# EasyEDA Pro project Controller Board DS-PI.epro, schematic Schematic1
Create Date: 2025-11-25; Page Name: P1; Project Name: DSBOARD; Schematic Name: Schematic1; Update Date: 2025-11-30; Company: EasyEDA.com; Page Size: A4; Version: V1.0
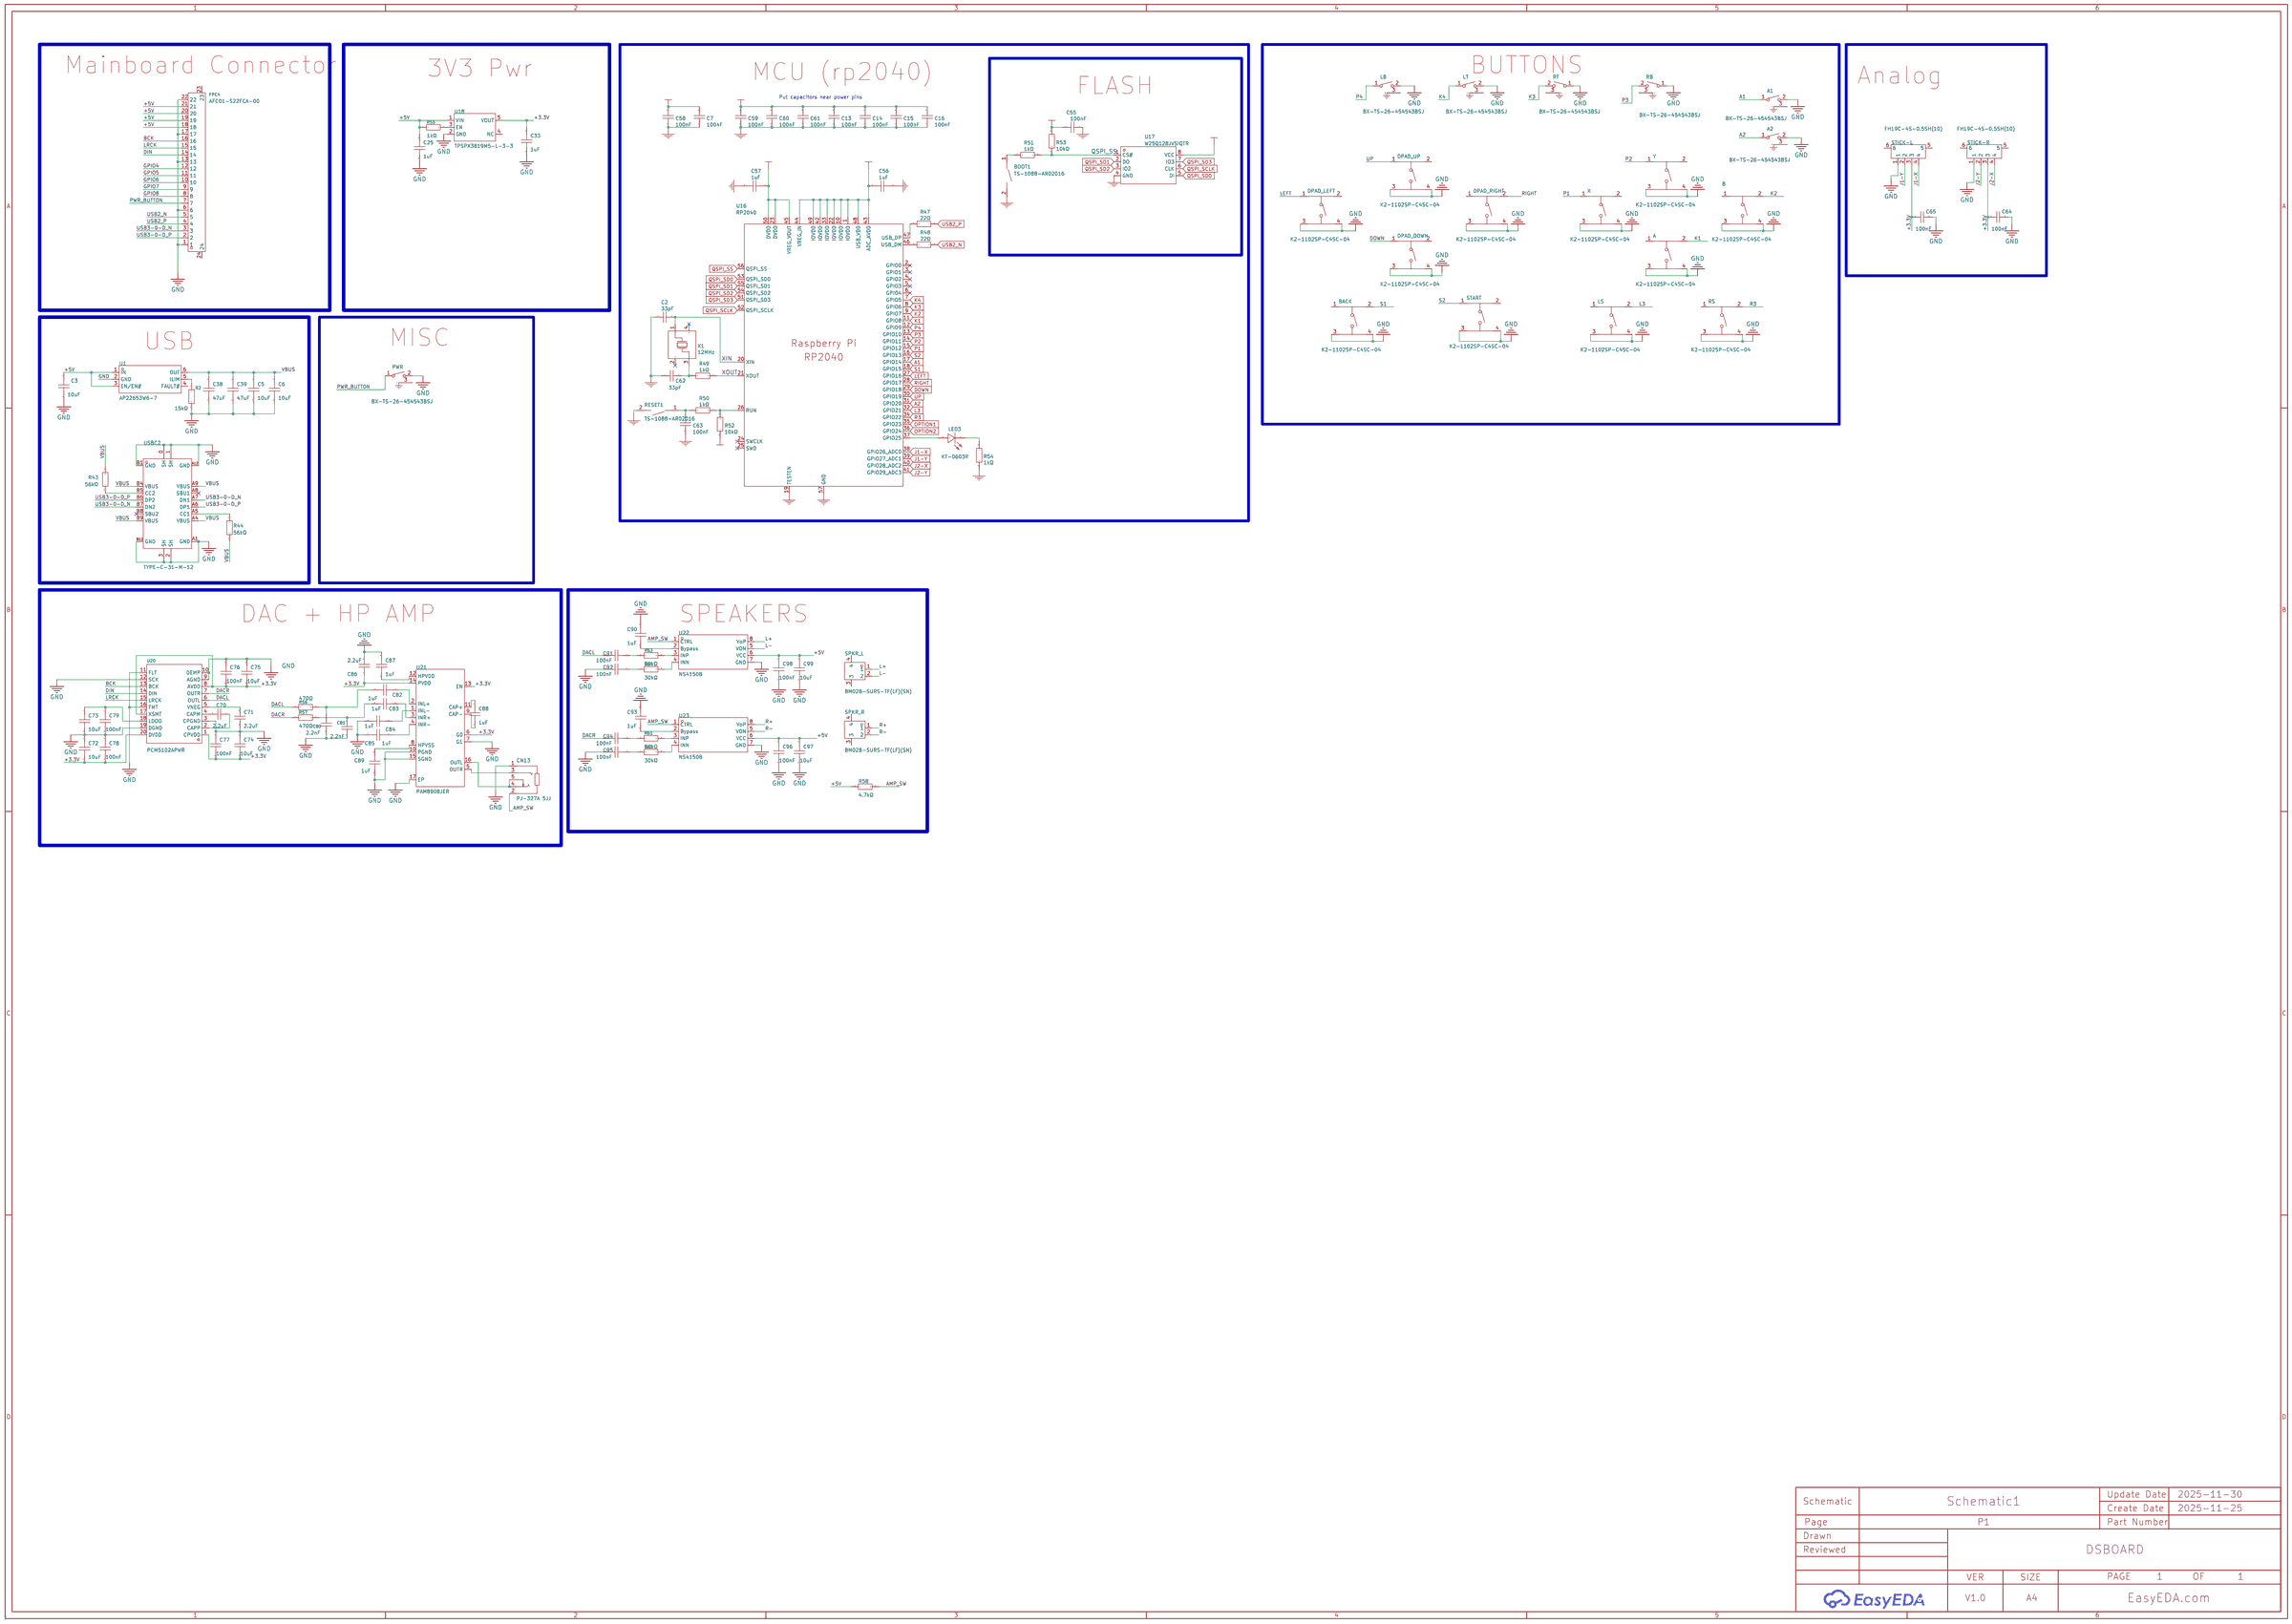
[diagram p0: schematic sheet]

## Parts
A  K2-1102SP-C4SC-04  [KEY-SMD_4P-L6.0-W6.0-P4.50-LS9.5-BL]  (no BOM)
A1  BX-TS-26-454543BSJ  [SW-TH_3P-L4.5-W4.3-P3.00-LS1.9]  (no BOM)
A2  BX-TS-26-454543BSJ  [SW-TH_3P-L4.5-W4.3-P3.00-LS1.9]  (no BOM)
B  K2-1102SP-C4SC-04  [KEY-SMD_4P-L6.0-W6.0-P4.50-LS9.5-BL]  (no BOM)
BACK  K2-1102SP-C4SC-04  [KEY-SMD_4P-L6.0-W6.0-P4.50-LS9.5-BL]  (no BOM)
BOOT1  TS-1088-AR02016  [SW-SMD_L3.9-W3.0-P4.45]
C2  33pF  [C0402]
C3  10uF  [C0805]
C5  10uF  [C0805]
C6  10uF  [C0805]
C7  100nF  [C0402]
C13  100nF  [C0402]
C14  100nF  [C0402]
C15  100nF  [C0402]
C16  100nF  [C0402]
C25  1uF  [C0603]
C33  1uF  [C0603]
C38  47uF  [C1206]
C39  47uF  [C1206]
C55  100nF  [C0402]
C56  1uF  [C0402]
C57  1uF  [C0402]
C58  100nF  [C0402]
C59  100nF  [C0402]
C60  100nF  [C0402]
C61  100nF  [C0402]
C62  33pF  [C0402]
C63  100nF  [C0402]
C64  100nF  [c0402]
C65  100nF  [c0402]
C70  2.2uF  [C0603]
C71  2.2uF  [C0603]
C72  10uF  [C0805]
C73  10uF  [C0805]
C74  10uF  [C0805]
C75  10uF  [C0805]
C76  100nF  [C0603]
C77  100nF  [C0603]
C78  100nF  [C0603]
C79  100nF  [C0603]
C80  2.2nF  [C0805]
C81  2.2nF  [C0805]
C82  1uF  [C0603]
C83  1uF  [C0603]
C84  1uF  [C0603]
C85  1uF  [C0603]
C86  2.2uF  [C0603]
C87  1uF  [C0603]
C88  1uF  [C0603]
C89  1uF  [C0603]
C90  1uF  [C0603]
C91  100nF  [C0402]
C92  100nF  [C0402]
C93  1uF  [C0603]
C94  100nF  [C0402]
C95  100nF  [C0402]
C96  100nF  [C0402]
C97  10uF  [C0805]
C98  100nF  [C0402]
C99  10uF  [C0805]
CN13  PJ-327A 5JJ  [AUDIO-SMD_PJ-327A5JJ]
DPAD_DOWN  K2-1102SP-C4SC-04  [KEY-SMD_4P-L6.0-W6.0-P4.50-LS9.5-BL]  (no BOM)
DPAD_LEFT  K2-1102SP-C4SC-04  [KEY-SMD_4P-L6.0-W6.0-P4.50-LS9.5-BL]  (no BOM)
DPAD_RIGHT  K2-1102SP-C4SC-04  [KEY-SMD_4P-L6.0-W6.0-P4.50-LS9.5-BL]  (no BOM)
DPAD_UP  K2-1102SP-C4SC-04  [KEY-SMD_4P-L6.0-W6.0-P4.50-LS9.5-BL]  (no BOM)
FPC4  AFC01-S22FCA-00  [FPC-SMD_P0.5-22P_FGS-XJ-H2.0]
LB  BX-TS-26-454543BSJ  [SW-TH_3P-L4.5-W4.3-P3.00-LS1.9]  (no BOM)
LED3  KT-0603R  [LED0603-RD]
LS  K2-1102SP-C4SC-04  [KEY-SMD_4P-L6.0-W6.0-P4.50-LS9.5-BL]  (no BOM)
LT  BX-TS-26-454543BSJ  [SW-TH_3P-L4.5-W4.3-P3.00-LS1.9]  (no BOM)
PWR  BX-TS-26-454543BSJ  [SW-TH_3P-L4.5-W4.3-P3.00-LS1.9]  (no BOM)
R2  15kΩ  [R0402]
R43  56kΩ  [R0402]
R44  56kΩ  [R0402]
R47  22Ω  [R0402]
R48  22Ω  [R0402]
R49  1kΩ  [R0402]
R50  1kΩ  [R0402]
R51  1kΩ  [R0402]
R52  10kΩ  [R0402]
R53  10kΩ  [R0402]
R54  1kΩ  [R0402]
R55  1kΩ  [R0402]
R56  470Ω  [R0805]
R57  470Ω  [R0805]
R58  4.7kΩ  [R0603]
R61  30kΩ  [R0603]
R62  30kΩ  [R0603]
R63  30kΩ  [R0603]
R64  30kΩ  [R0603]
RB  BX-TS-26-454543BSJ  [SW-TH_3P-L4.5-W4.3-P3.00-LS1.9]  (no BOM)
RESET1  TS-1088-AR02016  [SW-SMD_L3.9-W3.0-P4.45]
RS  K2-1102SP-C4SC-04  [KEY-SMD_4P-L6.0-W6.0-P4.50-LS9.5-BL]  (no BOM)
RT  BX-TS-26-454543BSJ  [SW-TH_3P-L4.5-W4.3-P3.00-LS1.9]  (no BOM)
SPKR_L  BM02B-SURS-TF(LF)(SN)  [CONN-SMD_2P-P0.80_BM02B-SURS-TF-LF-SN]
SPKR_R  BM02B-SURS-TF(LF)(SN)  [CONN-SMD_2P-P0.80_BM02B-SURS-TF-LF-SN]
START  K2-1102SP-C4SC-04  [KEY-SMD_4P-L6.0-W6.0-P4.50-LS9.5-BL]  (no BOM)
STICK-L  FH19C-4S-0.5SH(10)  [FPC-SMD_FH19C-4S-0.5SH]
STICK-R  FH19C-4S-0.5SH(10)  [FPC-SMD_FH19C-4S-0.5SH]
U1  AP22653W6-7  [SOT-23-6_L2.9-W1.6-P0.95-LS2.8-BR]
U16  RP2040  [LQFN-56_L7.0-W7.0-P0.4-EP]
U17  W25Q128JVSIQTR  [SOIC-8_L5.3-W5.3-P1.27-LS8.0-BL]
U18  TPSPX3819M5-L-3-3  [SOT-23-5_L3.0-W1.6-P0.95-LS2.8-BR]
U20  PCM5102APWR  [TSSOP-20_L6.5-W4.4-P0.65-LS6.4-BL]
U21  PAM8908JER  [QFN-16_L3.0-W3.0-P0.50-BL-EP1.7]
U22  NS4150B  [MSOP-8_L3.0-W3.0-P0.65-LS5.0-BL]
U23  NS4150B  [MSOP-8_L3.0-W3.0-P0.65-LS5.0-BL]
USBC2  TYPE-C-31-M-12  [USB-C_SMD-TYPE-C-31-M-12]
X  K2-1102SP-C4SC-04  [KEY-SMD_4P-L6.0-W6.0-P4.50-LS9.5-BL]  (no BOM)
X1  12MHz  [OSC-SMD_4P-L3.2-W2.5-BL]
Y  K2-1102SP-C4SC-04  [KEY-SMD_4P-L6.0-W6.0-P4.50-LS9.5-BL]  (no BOM)

## Library data of the parts
A B BACK DPAD_DOWN DPAD_LEFT DPAD_RIGHT DPAD_UP LS RS START X Y = K2-1102SP-C4SC-04: Circuit:SPST Actuator Style:Round Button Operating Force:250gf Mounting Style:Brick nogging Switch Length:6mm Switch Width:6mm Switch Height:5mm Contact Current:50mA Voltage Rating (DC):12V Insulation Resistance:100MΩ With Lamp:- Mechanical Life:10万次 Oper; LCSC Part Name: K2-1102SP-C4SC-04 贴片; Supplier Part: C127509; Manufacturer: 韩国韩荣; Supplier Footprint: SMD; JLCPCB Part Class: Extended Part; Datasheet: https://atta.szlcsc.com/upload/public/pdf/source/20180911/C188182_290538218D9CAA74C9E437566D743B7F.pdf; Supplier: LCSC; Circuit: SPST; Actuator Style: Round Button; Operating Force: 250gf; Mounting Style: Brick nogging; Switch Length: 6mm; Switch Width: 6mm; Switch Height: 5mm; Contact Current: 50mA; Voltage Rating (DC): 12V; Insulation Resistance: 100MΩ; Mechanical Life: 10万次; Operating Temperature: -25℃~+85℃
A1 A2 LB LT PWR RB RT = BX-TS-26-454543BSJ: Circuit:SPST Actuator Style:Round Button Operating Force:260gf Mounting Style:Direct Insert Switch Length:4.5mm Switch Width:4.5mm Switch Height:4.3mm Strike Gundam:Without bracket Contact Current:50mA Voltage Rating:12V Actuator/Cap Color:Black Pin Style; LCSC Part Name: 4.5x4.5x4.3边三脚; Supplier Part: C18078076; Manufacturer: Bossie(博锡); Supplier Footprint: 插件-3P,4.5x4.5mm; JLCPCB Part Class: Extended Part; Datasheet: https://atta.szlcsc.com/upload/public/pdf/source/20231017/C9E2CC52EFF4A1EA78B90A8989680BD6.pdf; Supplier: LCSC; Circuit: SPST; Actuator Style: Round Button; Operating Force: 260gf; Mounting Style: Direct Insert; Switch Length: 4.5mm; Switch Width: 4.5mm; Switch Height: 4.3mm; Strike Gundam: Without bracket; Contact Current: 50mA; Voltage Rating: 12V; Actuator/Cap Color: Black; Pin Style: PCPin; Mechanical Life: 100000 Times; Operating Temperature: -30℃~+80℃
BOOT1 RESET1 = TS-1088-AR02016: Circuit:SPST Actuator Style:Round Button Operating Force:160gf Mounting Style:Brick nogging Switch Length:4mm Switch Width:3mm Switch Height:2mm Strike Gundam:不带 Contact Current:50mA Voltage Rating (DC):12V Insulation Resistance:100MΩ Actuator/Cap Color:B; LCSC Part Name: 4*3*2mm 立贴 轻触开关; Supplier Part: C720477; Manufacturer: XUNPU(讯普); Supplier Footprint: SMD; JLCPCB Part Class: Basic Part; Datasheet: https://atta.szlcsc.com/upload/public/pdf/source/20200810/C720475_60D09DD6C54279ADDB2DC25100F1CC11.pdf; Supplier: LCSC; Circuit: SPST; Actuator Style: Round Button; Operating Force: 160gf; Mounting Style: Brick nogging; Switch Length: 4mm; Switch Width: 3mm; Switch Height: 2mm; Strike Gundam: 不带; Contact Current: 50mA; Voltage Rating (DC): 12V; Insulation Resistance: 100MΩ; Actuator/Cap Color: Black; Pin Style: SMDSplicing; Mechanical Life: 10万次; Operating Temperature: -30℃~+80℃
C2 C62 = 0402CG330J500NT: Supplier: LCSC; Manufacturer: FH(风华); Supplier Part: C1562; JLCPCB Part Class: Basic Part
C3 C5 C6 C97 C99 = CL21A106KAYNNNE_C15850: Capacitance: Tolerance:±10% Tolerance:±10% Voltage Rated: Temperature Coefficient:; LCSC Part Name: 10uF ±10% 25V; Supplier Part: C15850; Manufacturer: SAMSUNG(三星); Manufacturer Part: CL21A106KAYNNNE; Supplier Footprint: 0805; JLCPCB Part Class: Basic Part; Datasheet: https://atta.szlcsc.com/upload/public/pdf/source/20160218/1457707763339.pdf; Supplier: LCSC; Tolerance: ±10%
C7 C13-C16 C55 C58-C61 C63-C65 = CL05B104KO5NNNC: Supplier: LCSC; Manufacturer: SAMSUNG(三星); Supplier Part: C1525; JLCPCB Part Class: Basic Part
C25 C33 C82-C85 C87-C90 C93 = CL10A105KB8NNNC: Capacitance: Tolerance:±10% Tolerance:±10% Voltage Rated: Temperature Coefficient:; LCSC Part Name: 1uF ±10% 50V; Supplier Part: C15849; Manufacturer: SAMSUNG(三星); Supplier Footprint: 0603; JLCPCB Part Class: Basic Part; Datasheet: https://atta.szlcsc.com/upload/public/pdf/source/20160218/1457707763339.pdf; Supplier: LCSC; Tolerance: ±10%
C38 C39 = CL31A476MPHNNNE: Capacitance: Tolerance:±20% Tolerance:±20% Voltage Rated: Temperature Coefficient:; LCSC Part Name: 47uF ±20% 10V; Supplier Part: C96123; Manufacturer: SAMSUNG(三星); Supplier Footprint: 1206; JLCPCB Part Class: Basic Part; Datasheet: https://atta.szlcsc.com/upload/public/pdf/source/20160218/1457707763339.pdf; Supplier: LCSC; Tolerance: ±20%
C56 C57 = CL05A105KA5NQNC: Supplier: LCSC; Manufacturer: SAMSUNG(三星); Supplier Part: C52923; JLCPCB Part Class: Basic Part
C70 C71 C86 = CL10A225KO8NNNC: Capacitance: Tolerance:±10% Tolerance:±10% Voltage Rated: Temperature Coefficient:; LCSC Part Name: 2.2uF ±10% 16V; Supplier Part: C23630; Manufacturer: SAMSUNG(三星); Supplier Footprint: 0603; JLCPCB Part Class: Basic Part; Datasheet: https://atta.szlcsc.com/upload/public/pdf/source/20160218/1457707763339.pdf; Supplier: LCSC; Tolerance: ±10%
C72-C75 = GRM21BR61H106KE43L: Capacitance: Tolerance:±10% Tolerance:±10% Voltage Rated: Temperature Coefficient:; LCSC Part Name: 10uF ±10% 50V; Supplier Part: C440198; Manufacturer: muRata(村田); Supplier Footprint: 0805; JLCPCB Part Class: Basic Part; Datasheet: https://atta.szlcsc.com/upload/public/pdf/source/20230811/95AAE0C9AF55EDC31B7A4D8B733F534E.pdf; Supplier: LCSC; Tolerance: ±10%
C76-C79 = CC0603KRX7R9BB104: Capacitance:100nF Tolerance:±10% Tolerance:±10% Voltage Rating:50V Temperature Coefficient:X7R; LCSC Part Name: 100nF ±10% 50V; Supplier Part: C14663; Manufacturer: YAGEO(国巨); Supplier Footprint: 0603; JLCPCB Part Class: Basic Part; Datasheet: https://atta.szlcsc.com/upload/public/pdf/source/20180910/C282072_33301C7F631E79921B82A8DAC6BCC5B3.pdf; Supplier: LCSC; Tolerance: ±10%; Voltage Rating: 50V; Temperature Coefficient: X7R
C80 C81 = CL21C222JBFNNNE: Capacitance: Tolerance:±5% Tolerance:±5% Voltage Rated: Temperature Coefficient:; LCSC Part Name: 2.2nF ±5% 50V; Supplier Part: C28260; Manufacturer: SAMSUNG(三星); Supplier Footprint: 0805; JLCPCB Part Class: Basic Part; Datasheet: https://atta.szlcsc.com/upload/public/pdf/source/20160218/1457707763339.pdf; Supplier: LCSC; Tolerance: ±5%
C91 C92 C94-C96 C98 = CL05B104KB54PNC: Capacitance: Tolerance:±10% Tolerance:±10% Voltage Rated: Temperature Coefficient:; LCSC Part Name: 100nF ±10% 50V; Supplier Part: C307331; Manufacturer: SAMSUNG(三星); Supplier Footprint: 0402; JLCPCB Part Class: Basic Part; Datasheet: https://atta.szlcsc.com/upload/public/pdf/source/20160218/1457707763339.pdf; Supplier: LCSC; Tolerance: ±10%
CN13 = PJ-327A 5JJ: Connector Type:3.5mm Headphone Jack Current Rating:500mA Voltage Rating (Max):30V Contact Material:- Contact Plating:Gold Operating Temperature:-30℃~+70℃ Operating Temperature:-30℃~+70℃; LCSC Part Name: 3.5mm耳机座; Supplier Part: C668605; Manufacturer: SHOU HAN(首韩); Supplier Footprint: SMD; JLCPCB Part Class: Extended Part; Datasheet: https://item.szlcsc.com/datasheet/PJ-327A%25205JJ/698548.html; Supplier: LCSC; Connector Type: 3.5mm Headphone Jack; Current Rating: 500mA; Voltage Rating (Max): 30V; Contact Plating: Gold; Operating Temperature: -30℃~+70℃
FPC4 = AFC01-S22FCA-00: Locking Feature:Clamshell Contact Type:Bottom Contact Number of Contacts:22P Pitch:0.5mm Mounting Type:卧贴 FFC, FCB Thickness:0.3mm FFC, FCB Thickness:0.3mm Height Above Board:2mm; LCSC Part Name: 间距:0.5mm P数:22P 翻盖式 下接; Supplier Part: C262668; Manufacturer: JS(钜硕电子); Supplier Footprint: SMD,P=0.5mm,卧贴; JLCPCB Part Class: Extended Part; Datasheet: https://atta.szlcsc.com/upload/public/pdf/source/20190816/C413942_2A72D1AC756EAE17EEDF756A339D4500.pdf; Supplier: LCSC; Locking Feature: Clamshell; Contact Type: Bottom Contact; Number of Contacts: 22P; Pitch: 0.5mm; Mounting Type: 卧贴; FFC, FCB Thickness: 0.3mm; Height Above Board: 2mm; Contact Material: Phosphor bronze; Contact Plating: Gold; Operating Temperature Range: -40℃~+85℃
LED3 = KT-0603R: Emitted Color:Red Power Dissipation:- Forward Current:- Dominant Wavelength:- Dominant Wavelength:- Peak Wavelength:- Diode Configuration:- Lens Color:- Color Temperature:- Color Temperature:- Viewing Angle:- Mounting Sytle:- Operating Temperature:-40℃~+8; LCSC Part Name: 0603 红灯 高亮; Supplier Part: C2286; Manufacturer: KENTO; Supplier Footprint: 0603; JLCPCB Part Class: Basic Part; Datasheet: https://atta.szlcsc.com/upload/public/pdf/source/20160616/1466072038404.pdf; Supplier: LCSC; Emitted Color: Red; Operating Temperature: -40℃~+85℃
R2 = 0402WGF1502TCE: Type:Thick Film Resistors Resistance:15kΩ Tolerance:±1% Tolerance:±1% Power(Watts): Overload Voltage (Max): Temperature Coefficient:±100ppm/℃ Temperature Coefficient:±100ppm/℃ Operating Temperature Range:-55℃~+155℃ Operating Temperature Range:-55℃~+155℃; LCSC Part Name: 15kΩ ±1% 62.5mW 厚膜电阻; Supplier Part: C25756; Manufacturer: UNI-ROYAL(厚声); Supplier Footprint: 0402; JLCPCB Part Class: Basic Part; Datasheet: https://atta.szlcsc.com/upload/public/pdf/source/20200306/C422600_1E6D84923E4A46A82E41ADD87F860B5C.pdf; Supplier: LCSC; Type: Thick Film Resistors; Tolerance: ±1%; Temperature Coefficient: ±100ppm/℃; Operating Temperature Range: -55℃~+155℃
R43 R44 = 0402WGF5602TCE: Type:Thick Film Resistors Resistance:56kΩ Tolerance:±1% Tolerance:±1% Power(Watts): Overload Voltage (Max): Temperature Coefficient:±100ppm/℃ Temperature Coefficient:±100ppm/℃ Operating Temperature Range:-55℃~+155℃ Operating Temperature Range:-55℃~+155℃; LCSC Part Name: 56kΩ ±1% 62.5mW 厚膜电阻; Supplier Part: C25796; Manufacturer: UNI-ROYAL(厚声); Supplier Footprint: 0402; JLCPCB Part Class: Extended Part; Datasheet: https://atta.szlcsc.com/upload/public/pdf/source/20200306/C422600_1E6D84923E4A46A82E41ADD87F860B5C.pdf; Supplier: LCSC; Type: Thick Film Resistors; Tolerance: ±1%; Temperature Coefficient: ±100ppm/℃; Operating Temperature Range: -55℃~+155℃
R47 R48 = 0402WGF220JTCE: Supplier: LCSC; Manufacturer: UNI-ROYAL(厚声); Supplier Part: C25092; Resistance: 22; JLCPCB Part Class: Basic Part
R49-R51 R54 = 0402WGF1001TCE: Supplier: LCSC; Manufacturer: UNI-ROYAL(厚声); Supplier Part: C11702; Resistance: 1K; JLCPCB Part Class: Basic Part
R52 R53 = 0402WGF1002TCE: Supplier: LCSC; Manufacturer: UNI-ROYAL(厚声); Supplier Part: C25744; Resistance: 10K; JLCPCB Part Class: Basic Part
R55 = 0402WGF1001TCE: Type:Thick Film Resistors Resistance:1kΩ Tolerance:±1% Tolerance:±1% Power(Watts): Overload Voltage (Max): Temperature Coefficient:±100ppm/℃ Temperature Coefficient:±100ppm/℃ Operating Temperature Range:-55℃~+155℃ Operating Temperature Range:-55℃~+155℃; LCSC Part Name: 1kΩ ±1% 62.5mW 厚膜电阻; Supplier Part: C11702; Manufacturer: UNI-ROYAL(厚声); Supplier Footprint: 0402; JLCPCB Part Class: Basic Part; Datasheet: https://atta.szlcsc.com/upload/public/pdf/source/20200306/C422600_1E6D84923E4A46A82E41ADD87F860B5C.pdf; Supplier: LCSC; Type: Thick Film Resistors; Tolerance: ±1%; Temperature Coefficient: ±100ppm/℃; Operating Temperature Range: -55℃~+155℃
R56 R57 = 0805W8F4700T5E: Type:Thick Film Resistors Resistance: Tolerance:±1% Tolerance:±1% Power(Watts): Overload Voltage (Max): Temperature Coefficient:±100ppm/℃ Temperature Coefficient:±100ppm/℃ Operating Temperature Range:-55℃~+155℃ Operating Temperature Range:-55℃~+155℃; LCSC Part Name: 470Ω ±1% 125mW 厚膜电阻; Supplier Part: C17710; Manufacturer: UNI-ROYAL(厚声); Supplier Footprint: 0805; JLCPCB Part Class: Basic Part; Datasheet: https://atta.szlcsc.com/upload/public/pdf/source/20200306/C422600_1E6D84923E4A46A82E41ADD87F860B5C.pdf; Supplier: LCSC; Type: Thick Film Resistors; Tolerance: ±1%; Temperature Coefficient: ±100ppm/℃; Operating Temperature Range: -55℃~+155℃
R58 = 0603WAF4701T5E: Type:Thick Film Resistor Resistance:4.7kΩ Tolerance:±1% Tolerance:±1% Power(Watts):100mW Voltage-Supply(Max):75V Temperature Coefficient:±100ppm/℃ Temperature Coefficient:±100ppm/℃ Operating Temperature:-55℃~+155℃ Operating Temperature:-55℃~+155℃; LCSC Part Name: 4.7kΩ ±1% 100mW 厚膜电阻; Supplier Part: C23162; Manufacturer: UNI-ROYAL(厚声); Supplier Footprint: 0603; JLCPCB Part Class: Basic Part; Datasheet: https://item.szlcsc.com/datasheet/0603WAF4701T5E/23889.html; Supplier: LCSC; Type: Thick Film Resistor; Tolerance: ±1%; Power(Watts): 100mW; Voltage-Supply(Max): 75V; Temperature Coefficient: ±100ppm/℃; Operating Temperature: -55℃~+155℃
R61-R64 = 0603WAF3002T5E: Type:Thick Film Resistor Resistance:30kΩ Tolerance:±1% Tolerance:±1% Power(Watts):100mW Voltage-Supply(Max):75V Temperature Coefficient:±100ppm/℃ Temperature Coefficient:±100ppm/℃ Operating Temperature:-55℃~+155℃ Operating Temperature:-55℃~+155℃; LCSC Part Name: 30kΩ ±1% 100mW 厚膜电阻; Supplier Part: C22984; Manufacturer: UNI-ROYAL(厚声); Supplier Footprint: 0603; JLCPCB Part Class: Basic Part; Datasheet: https://item.szlcsc.com/datasheet/0603WAF3002T5E/23711.html; Supplier: LCSC; Type: Thick Film Resistor; Tolerance: ±1%; Power(Watts): 100mW; Voltage-Supply(Max): 75V; Temperature Coefficient: ±100ppm/℃; Operating Temperature: -55℃~+155℃
SPKR_L SPKR_R = BM02B-SURS-TF(LF)(SN): Pins Structure:1x2P Pitch:0.8mm Mounting Style:Vertical welding Reference Series:SUR Number of Pins:2P Number of Rows:1 Number of PINs Per Row:2 Row Spacing:- Current Rating (Max):500mA Contact Material:Copper Alloy Contact Plating:Tin Operating Temperatu; LCSC Part Name: 1x2P 间距:0.8mm 立贴 系列:SUR; Supplier Part: C385130; Manufacturer: JST; Supplier Footprint: SMD,P=0.8mm; JLCPCB Part Class: Extended Part; Datasheet: https://atta.szlcsc.com/upload/public/pdf/source/20200311/C495545_E72935403D1EB49F793AD89C21E66448.pdf; Supplier: LCSC; Pins Structure: 1x2P; Pitch: 0.8mm; Mounting Style: Vertical welding; Reference Series: SUR; Number of Pins: 2P; Number of Rows: 1; Number of PINs Per Row: 2; Current Rating (Max): 500mA; Contact Material: Copper Alloy; Contact Plating: Tin; Operating Temperature Range: -25℃~+85℃; Rated Voltage (Max): 30V; Plastic Material: PA; Flame Retardant Rating: UL94V-0; Supplementary Features: 辅助焊脚; Colour: White; Z-Height of the Board: 2.7mm; X-Length of Bottom Edge on Board (Spacing Line): 3.8mm; Y-Width of Bottom Edge on Board: 2mm
STICK-L STICK-R = FH19C-4S-0.5SH(10): Locking Feature:Clamshell Contact Type:Bottom Contact Number of Contacts:4P Pitch:0.5mm Mounting Type:卧贴 FFC, FCB Thickness:0.2mm FFC, FCB Thickness:0.2mm Height Above Board:0.88mm Contact Material:Phosphor bronze Contact Plating:Gold Operating Temperatur; LCSC Part Name: 间距:0.5mm P数:4P 翻盖式 下接; Supplier Part: C424650; Manufacturer: HRS(广濑); Supplier Footprint: SMD,P=0.5mm,卧贴; JLCPCB Part Class: Extended Part; Datasheet: https://atta.szlcsc.com/upload/public/pdf/source/20190903/C424652_96088C35DDF9B9746B51C85A1732CDEC.pdf; Supplier: LCSC; Locking Feature: Clamshell; Contact Type: Bottom Contact; Number of Contacts: 4P; Pitch: 0.5mm; Mounting Type: 卧贴; FFC, FCB Thickness: 0.2mm; Height Above Board: 0.88mm; Contact Material: Phosphor bronze; Contact Plating: Gold; Operating Temperature Range: -55℃~+85℃
U1 = AP22653W6-7: Number of Outputs:1 Output Current:2.1A Input Voltage:3V~5.5V Input Voltage:3V~5.5V Resistor On-State:65mΩ Operating Temperature -:-40℃~+85℃ Operating Temperature -:-40℃~+85℃; Supplier Part: C2158037; Manufacturer: DIODES(美台); Supplier Footprint: SOT-26; JLCPCB Part Class: Extended Part; Datasheet: https://atta.szlcsc.com/upload/public/pdf/source/20210630/864BBA6F47FEA2EACA8A2C6E64AF9219.pdf; Supplier: LCSC; Number of Outputs: 1; Output Current: 2.1A; Input Voltage: 3V~5.5V; Resistor On-State: 65mΩ; Operating Temperature	-: -40℃~+85℃
U16 = RP2040: Supplier: LCSC; Supplier Part: C2040; Manufacturer: Raspberry Pi(树莓派); JLCPCB Part Class: Extended Part
U17 = W25Q128JVSIQ: Supplier: LCSC; Manufacturer: WINBOND(华邦); Supplier Part: C97521; JLCPCB Part Class: Basic Part
U18 = TPSPX3819M5-L-3-3: Output Type:Fixed Voltage - Supply:20V Output Voltage:3.3V Output Voltage:3.3V Output Current:500mA Power Supply Rejection Ratio (PSRR):- Operating Temperature:-40℃~+125℃@(Tj) Operating Temperature:-40℃~+125℃@(Tj) Output Configuration:Positive electrode N; Supplier Part: C5370980; Manufacturer: TECH PUBLIC(台舟); Supplier Footprint: SOT-23-5; JLCPCB Part Class: Extended Part; Datasheet: https://atta.szlcsc.com/upload/public/pdf/source/20231102/1CEED3DA25748E8590103A514E6172D9.pdf; Supplier: LCSC; Output Type: Fixed; Voltage - Supply: 20V; Output Voltage: 3.3V; Output Current: 500mA; Operating Temperature: -40℃~+125℃@(Tj); Output Configuration: Positive electrode; Number of Outputs: 1
U20 = PCM5102APWR: Interface Type:PCM Supply Voltage:1.65V~3.46V Supply Voltage:1.65V~3.46V Number of Channels:2 Resolution:24；16；32 Operating Temperature:-25℃~+85℃ Operating Temperature:-25℃~+85℃; Supplier Part: C107671; Manufacturer: TI(德州仪器); Supplier Footprint: TSSOP-20; JLCPCB Part Class: Extended Part; Datasheet: https://www.ti.com/cn/lit/gpn/pcm5102a; Supplier: LCSC; Interface Type: PCM; Supply Voltage: 1.65V~3.46V; Number of Channels: 2; Resolution: 24；16；32; Operating Temperature: -25℃~+85℃
U21 = PAM8908JER: Class:AB Class Amplifier Speaker Channels:Dual Channel Output Power:35mWx2@16Ω Voltage - Supply:2.5V~5.5V Voltage - Supply:2.5V~5.5V; LCSC Part Name: 35mW立体声AB类音频功率放大器; Supplier Part: C33233; Manufacturer: DIODES(美台); Supplier Footprint: QFN-16-EP(3x3); JLCPCB Part Class: Extended Part; Datasheet: https://atta.szlcsc.com/upload/public/pdf/source/20241225/198AA8C4DF618023934B9402F7273380.pdf; Supplier: LCSC; Class: AB Class Amplifier; Speaker Channels: Dual Channel; Output Power: 35mWx2@16Ω; Voltage - Supply: 2.5V~5.5V
U22 U23 = NS4150B_C189961: Class:Class D Output Power:3Wx1@4Ω Voltage - Supply:3V~5.25V Voltage - Supply:3V~5.25V; Supplier Part: C189961; Manufacturer: Nsiway(纳芯威); Supplier Footprint: MSOP-8; JLCPCB Part Class: Extended Part; Datasheet: https://item.szlcsc.com/datasheet/NS4150B/207582.html; Supplier: LCSC; Class: Class D; Output Power: 3Wx1@4Ω; Voltage - Supply: 3V~5.25V
USBC2 = TYPE-C-31-M-12: Connector Type:Type-C Standard:- Gender:Female Mounting Style:- Number of Contacts:16P Number of Ports:1 Current Rating - Power (Max):5A Operating Temperature Range:- Operating Temperature Range:-; LCSC Part Name: Type-C 母; Supplier Part: C165948; Manufacturer: 韩国韩荣; Supplier Footprint: SMD; JLCPCB Part Class: Extended Part; Datasheet: https://atta.szlcsc.com/upload/public/pdf/source/20220525/466408E853115E789EDB0DDC29077C05.pdf; Supplier: LCSC; Connector Type: Type-C; Gender: Female; Number of Contacts: 16P; Number of Ports: 1; Current Rating - Power (Max): 5A
X1 = X322512MSB4SI: Supplier: LCSC; Manufacturer: YXC; Supplier Part: C9002; JLCPCB Part Class: Basic Part

## Nets
+1V1: C7.2 C57.1 C58.2 U16.23(DVDD) U16.45(VREG_VOUT) U16.50(DVDD)
+3.3V: C13.2 C14.2 C15.2 C16.2 C33.1 C55.2 C56.1 C59.2 C60.2 C61.2 C64.1 C65.1 C72.2 C74.2 C75.2 C76.2 C77.2 C78.2 C86.1 R52.1 R53.2 STICK-L.3 STICK-R.3 U16.1(IOVDD) U16.10(IOVDD) U16.22(IOVDD) U16.33(IOVDD) U16.42(IOVDD) U16.43(ADC_AVDD) U16.44(VREG_IN) U16.48(USB_VDD) U16.49(IOVDD) U17.8(VCC) U18.5(VOUT) U20.1(CPVDD) U20.8(AVDD) U20.17(XSMT) U20.20(DVDD) U21.6(G0) U21.13(EN) U21.14(PVDD)
+5V: C3.1 C25.1 C96.2 C97.2 C98.2 C99.2 FPC4.18 FPC4.19 FPC4.20 FPC4.21 R55.1 R58.1 U1.1(IN) U1.3(EN/EN#) U18.1(VIN) U22.6(VCC) U23.6(VCC)
GND: A.3 A.4 A1.2 A2.2 B.3 B.4 BACK.3 BACK.4 BOOT1.2 C2.1 C3.2 C5.2 C6.2 C7.1 C13.1 C14.1 C15.1 C16.1 C25.2 C33.2 C38.2 C39.2 C55.1 C56.2 C57.2 C58.1 C59.1 C60.1 C61.1 C62.1 C63.1 C64.2 C65.2 C71.1 C72.1 C73.2 C74.1 C75.1 C76.1 C77.1 C78.1 C79.2 C80.2 C81.2 C84.2 C85.2 C86.2 C87.2 C89.1 C90.2 C92.1 C93.2 C95.1 C96.1 C97.1 C98.1 C99.1 CN13.1 DPAD_DOWN.3 DPAD_DOWN.4 DPAD_LEFT.3 DPAD_LEFT.4 DPAD_RIGHT.3 DPAD_RIGHT.4 DPAD_UP.3 DPAD_UP.4 FPC4.1 FPC4.6 FPC4.13 FPC4.17 FPC4.22 LB.2 LS.3 LS.4 LT.2 PWR.2 R2.2 R54.1 RB.1 RESET1.2 RS.3 RS.4 RT.1 START.3 START.4 STICK-L.1 STICK-R.1 U1.2(GND) U16.19(TESTEN) U16.57(GND) U17.4(GND) U18.2(GND) U20.3(CPGND) U20.9(AGND) U20.10(DEMP) U20.11(FLT) U20.12(SCK) U20.16(FMT) U20.19(DGND) U21.7(G1) U21.10(PGND) U21.15(SGND) U21.17(EP) U22.7(GND) U23.7(GND) USBC2.0(SH) USBC2.1(SH) USBC2.2(SH) USBC2.3(SH) USBC2.A1(GND) USBC2.A12(GND) USBC2.B1(GND) USBC2.B12(GND) X.3 X.4 Y.3 Y.4
VBUS: C5.1 C6.1 C38.1 C39.1 R43.2 R44.2 U1.6(OUT) USBC2.A4(VBUS) USBC2.A9(VBUS) USBC2.B4(VBUS) USBC2.B9(VBUS)
A1: A1.1 U16.17(GPIO14)
A2: A2.1 U16.31(GPIO20)
AMP_SW: CN13.2 R58.2 U22.1(CTRL) U23.1(CTRL)
BCK: FPC4.16 U20.13(BCK)
DACL: C91.1 R56.1 U20.6(OUTL)
DACR: C94.1 R57.1 U20.7(OUTR)
DIN: FPC4.14 U20.14(DIN)
DOWN: DPAD_DOWN.1 U16.29(GPIO18)
GPIO4: FPC4.12
GPIO5: FPC4.11
GPIO6: FPC4.10
GPIO7: FPC4.9
GPIO8: FPC4.8
J1-X: STICK-L.4 U16.38(GPIO26_ADC0)
J1-Y: STICK-L.2 U16.39(GPIO27_ADC1)
J2-X: STICK-R.4 U16.40(GPIO28_ADC2)
J2-Y: STICK-R.2 U16.41(GPIO29_ADC3)
K1: A.2 U16.11(GPIO8)
K2: B.2 U16.9(GPIO7)
K3: RT.2 U16.8(GPIO6)
K4: LT.1 U16.7(GPIO5)
L3: LS.2 U16.32(GPIO21)
L+: SPKR_L.1 U22.8(VoP)
L-: SPKR_L.2 U22.5(VON)
LEFT: DPAD_LEFT.1 U16.27(GPIO16)
LRCK: FPC4.15 U20.15(LRCK)
OPTION1: U16.35(GPIO23)
OPTION2: U16.36(GPIO24)
P1: U16.15(GPIO12) X.1
P2: U16.14(GPIO11) Y.1
P3: RB.2 U16.13(GPIO10)
P4: LB.1 U16.12(GPIO9)
PWR_BUTTON: FPC4.7 PWR.1
QSPI_SCLK: U16.52(QSPI_SCLK) U17.6(CLK)
QSPI_SD0: U16.53(QSPI_SD0) U17.5(DI)
QSPI_SD1: U16.55(QSPI_SD1) U17.2(DO)
QSPI_SD2: U16.54(QSPI_SD2) U17.3(IO2)
QSPI_SD3: U16.51(QSPI_SD3) U17.7(IO3)
QSPI_SS: R51.2 R53.1 U16.56(QSPI_SS) U17.1(CS#)
R3: RS.2 U16.34(GPIO22)
R+: SPKR_R.1 U23.8(VoP)
R-: SPKR_R.2 U23.5(VON)
RIGHT: DPAD_RIGHT.2 U16.28(GPIO17)
S1: BACK.2 U16.18(GPIO15)
S2: START.1 U16.16(GPIO13)
UP: DPAD_UP.1 U16.30(GPIO19)
USB2_N: FPC4.5 R48.2
USB2_P: FPC4.4 R47.1
USB3-0-D_N: FPC4.3 USBC2.A7(DN1) USBC2.B7(DN2)
USB3-0-D_P: FPC4.2 USBC2.A6(DP1) USBC2.B6(DP2)
XIN: C2.2 U16.20(XIN) X1.1(OSC1)
XOUT: R49.2 U16.21(XOUT)
$1N5125: R43.1 USBC2.B5(CC2)
$1N5126: R44.1 USBC2.A5(CC1)
$1N5147: R2.1 U1.5(ILIM)
$1N5203: LED3.1(K) R54.2
$1N5210: C62.2 R49.1 X1.3(OSC2)
$1N5217: BOOT1.1 R51.1
$1N5218: R50.2 R52.2 U16.26(RUN)
$1N5219: LED3.2(A) U16.37(GPIO25)
$1N5220: R47.2 U16.47(USB_DP)
$1N5221: C63.2 R50.1 RESET1.1
$1N5239: R48.1 U16.46(USB_DM)
$1N5319: R55.2 U18.3(EN)
$1N5344: C70.2 U20.4(CAPM)
$1N5349: C70.1 U20.2(CAPP)
$1N5350: C71.2 U20.5(VNEG)
$1N5352: C73.1 C79.1 U20.18(LDOO)
$1N5360: C81.1 C83.2 R57.2
$1N5361: C80.1 C82.2 R56.2
$1N5362: C82.1 U21.2(INL+)
$1N5365: C85.1 U21.4(INR-)
$1N5368: C87.1 U21.12(HPVDD)
$1N5369: C88.2 U21.11(CAP+)
$1N5370: C88.1 U21.9(CAP-)
$1N5382: C89.2 U21.8(HPVSS)
$1N9109: CN13.3 U21.5(OUTR)
$1N9136: CN13.4 CN13.5 U21.16(OUTL)
$1N24333: C83.1 U21.3(INR+)
$1N24340: C84.1 U21.1(INL-)
$1N24601: C90.1 U22.2(Bypass)
$1N24795: C91.2 R63.1
$1N24871: C92.2 R64.1
$1N24873: R63.2 U22.3(INP)
$1N24877: R64.2 U22.4(INN)
$1N24927: C93.1 U23.2(Bypass)
$1N25083: R62.2 U23.4(INN)
$1N25086: R61.2 U23.3(INP)
$1N25088: C95.2 R62.1
$1N25090: C94.2 R61.1

Not connected (* = marked no-connect by the designer): A 1; A1 3(GND); A2 3(GND); B 1; BACK 1; DPAD_DOWN 2; DPAD_LEFT 2; DPAD_RIGHT 1; DPAD_UP 2; FPC4 23 24; LB 3(GND); LS 1; LT 3(GND); PWR 3(GND); RB 3(GND); RS 1; RT 3(GND); SPKR_L 3 4; SPKR_R 3 4; START 2; STICK-L 5 6; STICK-R 5 6; U1 4(FAULT#); U16 2(GPIO0)* 3(GPIO1)* 4(GPIO2)* 5(GPIO3)* 6(GPIO4)* 24(SWCLK)* 25(SWD)*; U18 4(NC); USBC2 A8(SBU1)* B8(SBU2)*; X 2; X1 2(GND)* 4(GND)*; Y 2

## Notes on the sheet
- Mainboard Connector
- 3V3 Pwr
- BUTTONS
- MCU (rp2040)
- Analog
- FLASH
- Put capacitors near power pins
- MISC
- USB
- DAC + HP AMP
- SPEAKERS
